# Altium schematic sheet Logger Schematic.SchDoc
size A4
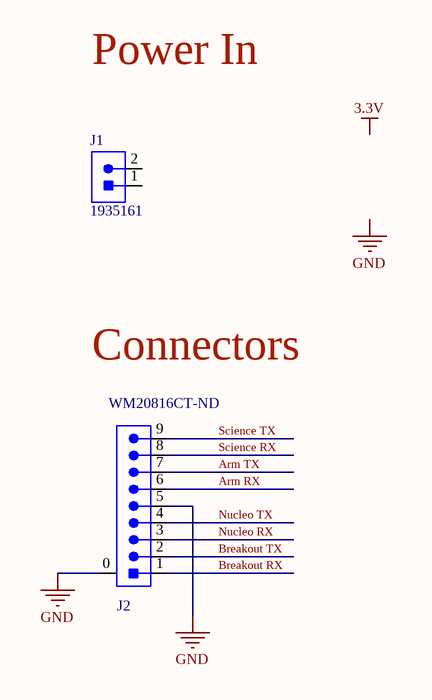
[diagram p0: Logger Schematic.SchDoc]

## Parts
J1  1935161  [1935161]
J2  Supplier Part Number 1: WM20816CT-ND  [Molex-5025850970]  (hidden comment: CON_9M_SM_RA)

## Nets
GND: J2.0 J2.5
Arm RX: J2.6
Arm TX: J2.7
Breakout RX: J2.1
Breakout TX: J2.2
Nucleo RX: J2.3
Nucleo TX: J2.4
Science RX: J2.8
Science TX: J2.9

Not connected (* = marked no-connect by the designer): J1 1 2

## Notes on the sheet
- Power In
- Connectors
- Labels drawn without touching a wire or pin: 3.3V, GND

## Library data of the parts
J1 = CON_2M_TERM: TERM BLK 2POS SIDE ENTRY 5MM; Manufacturer 1: Phoenix Contact; Connector Type: Screw; Voltage Rating (DC): 320V; Max Current Rating: 16A; Max Supply Voltage: 250V; Current Rating: 17.5A; Number of Poles: 2; Number of Levels: 1; Current: 18A; Voltage: 300V; Wire Gauge (Max): 26AWG; Wire Gauge (Min): 12AWG; Approvals: UL; Supplier 1: Digi-Key; Mount: Through Hole; Number of Pins: 2; Weight: 0.067021oz; Contact Material: Copper,Tin; Insulation Material: Nylon; Housing Material: Polyamide; Housing Color: Green; Color: Green; Material: Nylon; Number of Rows: 1; Voltage Rating: 250V; Number of Positions: 2; Number of Positions Per Level: 2; Termination: Solder; Number of Contacts: 2; Number of Circuits: 2; Orientation: Straight; Length: 9mm; Height: 11.3mm; Width: 14.9mm; Pitch: 5mm; Depth: 9mm; Wire/Cable Gauge: 26AWG; Flammability Rating: UL94 V-0; REACH SVHC: Unknown; Supplier Part Number 1: 277-1667-ND; Manufacturer Part Number 1: 1935161
J2 = CON_9M_SM_RA: CONN RCPT 9POS CLIK-MATE 0.059 TIN SMD R/A; Manufacturer: Molex; Manufacturer Part Number: 5025850970; Connector Type: Receptacle,Center Strip Contact; Number of Positions: 9; Current Rating: 2A; Contact Resistance: 20mR; Pitch: 1.5mm; Glow Wire Compliant: Non-compliant; Supplier 1: Digi-Key; Category: Headers and Wire Housings; Mount: Surface Mount; Housing Material: Resin; Color: Beige; Housing Color: Beige; Contact Plating: Tin; Contact Material: Copper Alloy; Min Operating Temperature: -40°C; Max Operating Temperature: 85°C; Termination: Solder; Number of Contacts: 9; Number of Rows: 1; Fastening Type: Latch; Orientation: Right Angle; Number of Circuits: 9; Length: 17.8mm; Depth: 7.3mm; REACH SVHC: No SVHC